# EAGLE design I2C 3-axis Compass (EAGLE 5.10)
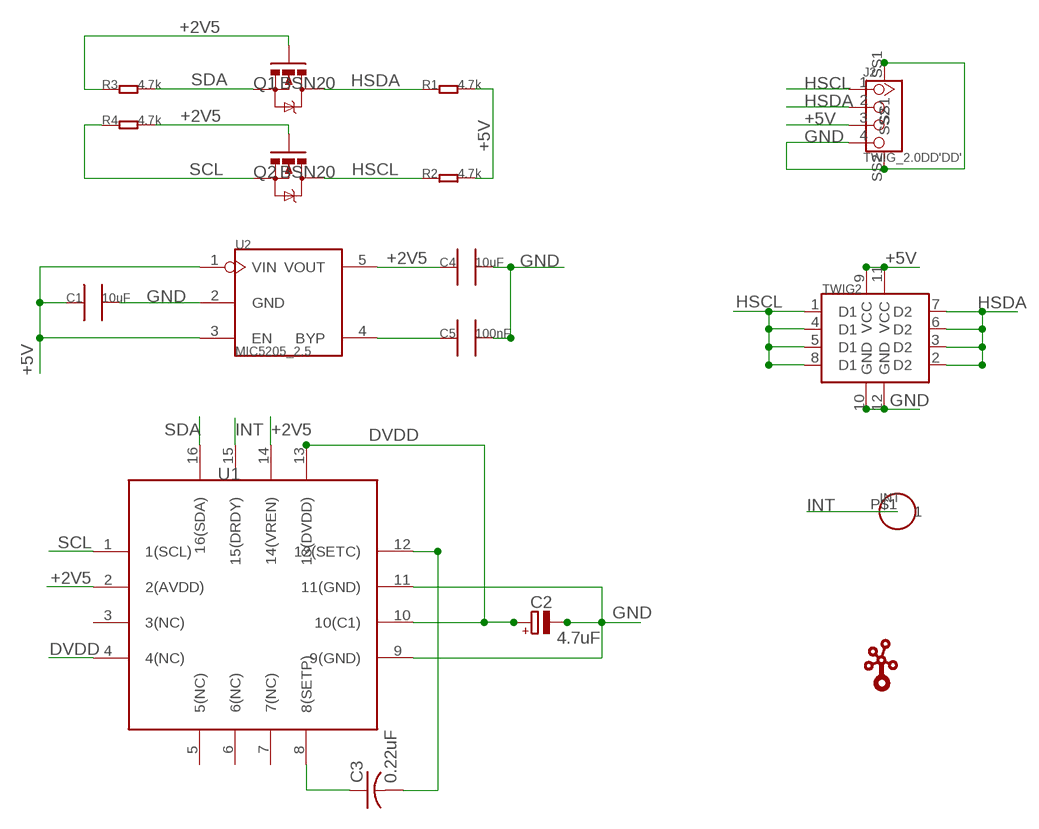
[diagram p0: schematic, sheet 1]

## Parts
C1  10uF  C0805_S  [0805_S]
C2  4.7uF  CPOL1206CPOL1206  [CPOL1206]
C3  0.22uF  C-USC0603  [C0603]
C4  10uF  C0805_S  [0805_S]
C5  100nF  C0603_S  [0603_S]
INT  CK_1X132  [CK_1X1]
J2  TWIG_2.0DD'DD'  [2.0_1X4DD]
Q1  BSN20  N_MOS  [SOT23]
Q2  BSN20  N_MOS  [SOT23]
R1  4.7k  R0603_S  [0603_S]
R2  4.7k  R0603_S  [0603_S]
R3  4.7k  R0603_S  [0603_S]
R4  4.7k  R0603_S  [0603_S]
TWIG2  TWIG-U1  [U1]
U1  HMC5883HMC5883  [HMC5883]
U2  MIC5205_2.5  MIC5025_X.X  [SOT23-5]
U$1  TWIGLOGOTWIGLOGO_SMALL  [TWIGLOGO_SMALL]

## Nets
+2V5: C4.1 Q1.1(G) Q2.1(G) R3.1 R4.2 U1.2(2(AVDD)) U1.14(14(VREN)) U2.5(VOUT)
+5V: C1.1 J2.3 R1.2 R2.2 TWIG2.9(VCC) TWIG2.11(VCC) U2.1(VIN) U2.3(EN)
DVDD: C2.2(+) U1.4(4(NC)) U1.10(10(C1)) U1.13(13(DVDD))
GND: C1.2 C2.1(-) C4.2 C5.2 J2.4 J2.SS1 J2.SS2 TWIG2.10(GND) TWIG2.12(GND) U1.9(9(GND)) U1.11(11(GND)) U2.2(GND)
HSCL: J2.1 Q2.3(D) R2.1 TWIG2.1(D1) TWIG2.4(D1) TWIG2.5(D1) TWIG2.8(D1)
HSDA: J2.2 Q1.3(D) R1.1 TWIG2.2(D2) TWIG2.3(D2) TWIG2.6(D2) TWIG2.7(D2)
INT: INT.P$1 U1.15(15(DRDY))
N$1: C3.2 U1.12(12(SETC))
N$2: C3.1 U1.8(8(SETP))
N$3: C5.1 U2.4(BYP)
SCL: Q2.2(S) R4.1 U1.1(1(SCL))
SDA: Q1.2(S) R3.2 U1.16(16(SDA))
Unconnected: U1.3(3(NC)) U1.5(5(NC)) U1.6(6(NC)) U1.7(7(NC))

## Library data of the parts
C1 C4 = CPT_SMD:C0805
C2 = rcl:CPOL1206
C3 = rcl:C-US: CAPACITOR, American symbol
C5 = CPT_SMD:C0603
INT = CONNECTER1:CK_1X1
J2 = CONNECTER:TWIG_2.0DD
Q1 Q2 = CPT_SMD:N_MOS
R1-R4 = CPT_SMD:R0603
TWIG2 = twig_template2:TWIG-U1
U1 = job:HMC5883
U2 = ICs_v54:MIC5025_X.X
U$1 = seeedleo:TWIGLOGO

## Net classes
0 default: width 0.203 mm, drill 0.305 mm, clearance 0.203 mm

## Board
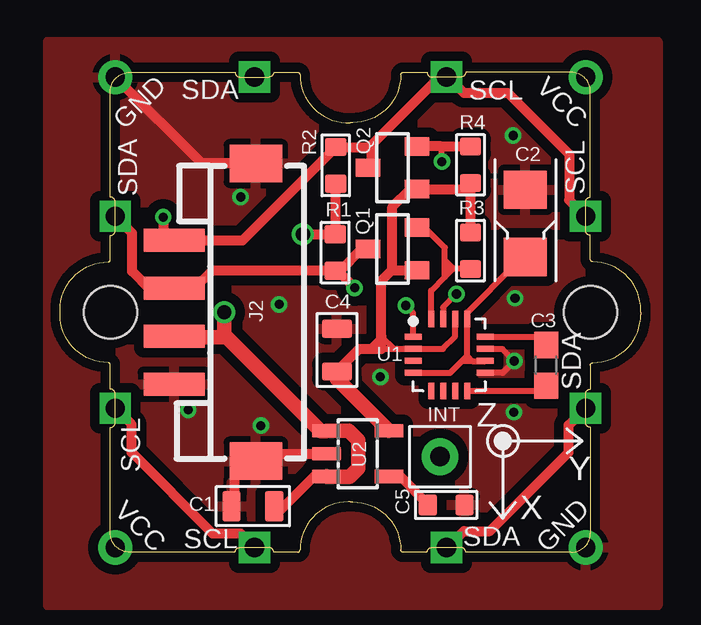
[diagram p1: board, top side]
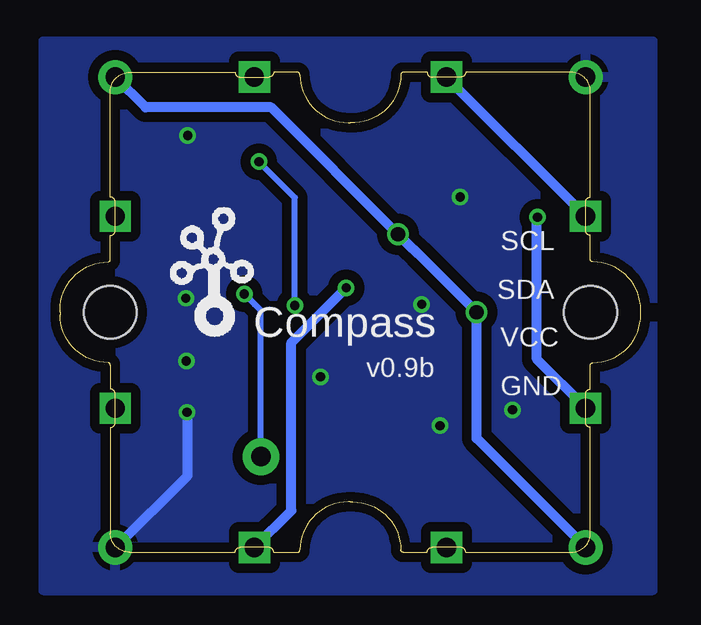
[diagram p2: board, bottom side, seen from below]

Size 24.2 x 20 mm. Coordinates in mm from the lower left corner, seen from the top.
Copper layers (1*16): Top 0.035mm / dielectric 1.5mm / Bottom 0.035mm
Design rules "SeeedStudio_rule_no_angle_090911": minimum track width 6mil, minimum drill 12mil, track to track 6mil, track to pad 6mil, pad to pad 6mil, via to via 6mil, smd to smd 0mil, copper to edge 10mil, drill to drill 10mil, minimum pad ring 10mil, minimum via ring 6mil, stop-mask expansion 2mil, vias tented up to drill 100mil, thermal gap 10mil

### Footprints (pad centres in the part's own frame; a part is rotated, then mirrored left to right if it is on the bottom)
0805_S = smd 0.762 x 1.27: 1 -0.889,0; 2 0.889,0
CPOL1206 = smd 1.6 x 1.8: 1 0,0; 2 2.8,0
C0603 = smd 1.1 x 1: 1 -0.85,0; 2 0.85,0
0603_S = smd 0.762 x 0.889: 1 -0.762,0; 2 0.762,0
CK_1X1 = drill 0.813 pad 1.524 round: P$1 0,0
2.0_1X4DD = smd 0.965 x 2.54: 1 -3,0; 2 -1,0; 3 1,0; 4 3,0 | smd 1.55 x 2.184: SS1 -6.2,3.4; SS2 6.2,3.4
SOT23 = smd 0.762 x 1.016: 1 -0.889,-1.016; 2 0.889,-1.016; 3 0,1.016
U1 = drill 0.8 pad 1.27 square: 1 -4,9.8; 2 4,9.8; 3 9.8,4; 4 9.8,-4; 5 4,-9.8; 6 -4,-9.8; 7 -9.8,-4; 8 -9.8,4 | drill 0.8 pad 1.422 round: 9 -9.8,9.8; 10 9.8,9.8; 11 9.8,-9.8; 12 -9.8,-9.8 | hole 2.2: 0,-10; 0,10
HMC5883 = smd 0.7 x 0.25: 1 0,2.25; 2 0,1.75; 3 0,1.25; 4 0,0.75; 9 3,0.75; 10 3,1.25; 11 3,1.75; 12 3,2.25 | smd 0.25 x 0.7: 5 0.75,0; 6 1.25,0; 7 1.75,0; 8 2.25,0; 13 2.25,3; 14 1.75,3; 15 1.25,3; 16 0.75,3
SOT23-5 = smd 0.55 x 1.2: 1 -0.95,-1.3; 2 0,-1.3; 3 0.95,-1.3; 4 0.95,1.3; 5 -0.95,1.3

### Placement (x,y rotation side)
C1  8.04,1.92 180 top
C2  19.39,15.11 270 top
C3  20.25,7.79 90 top
C4  11.54,8.43 90 top
C5  16.09,1.97 0 top
INT  15.83,3.98 270 top
J2  4.76,10 270 top
Q1  13.85,12.64 90 top
Q2  13.85,16.02 90 top
R1  11.46,12.49 90 top
R2  11.49,16.12 270 top
R3  17.1,12.57 270 top
R4  17.1,16.15 270 top
TWIG2  12.1,10 90 top
U1  14.72,6.72 0 top
U2  12.4,4.11 270 top
U$1  20,8.86 0 bottom

### Tracks (layer width: path | path; a pad name or v marks a point on that pad's centre or on a via)
+2V5
  Top 0.254: U1.14 16.47,8.98 15.96,8.47 U1.2 13.4,8.47 | 12.89,8.48 13.4,8.98 13.9,8.48
  Top 0.406: Q1.1 14.69,11.75 | C4.1 12.48,8.47 13.4,8.47 13.4,8.98 13.4,11.32 13.83,11.75 13.85,11.75 | Q1.1 14.59,11.75 | 13.85,11.75 13.85,14.39 14.59,15.13 Q2.1 16.93,15.13 R4.2 R3.1 | 13.85,11.75 Q1.1
  Top 0.61: C4.1 11.54,7.22 U2.5
+5V  (via drill 0.6)
  Top 0.406: R2.2 11.49,13.28 R1.2 v10.12,13.25 | U2.3 10.59,3.16 9.15,1.72 9.13,1.72 C1.1
  Top 0.61: 4.84,8.96 4.79,9 J2.3 4.8,8.96 6.82,8.96 | 11.11,3.17 U2.3 11.12,3.14 12.07,3.14 12.43,3.5 12.43,4.67 12.04,5.06 U2.1 10.86,5.05 6.94,8.96 6.82,8.96 | v6.84,10 6.84,8.98 6.82,8.96
  Bottom 0.406: TWIG2.9 6.84,4.74 v6.84,10 9.28,12.44 v10.12,13.25 15.4,18.53 20.63,18.53 TWIG2.11
DVDD
  Top 0.254: 16.97,8.18 U1.13 16.97,9.99 18.96,11.98 19.07,11.98 C2.2 | 16.97,8.18 17.18,7.97 | 17.18,7.97 U1.10 | U1.4 16.26,7.47 16.97,8.18 | 17.18,7.97 16.75,7.97
GND  (via drill 0.38)
  Top 0.254: U1.11 18.43,8.47 v18.93,7.97 18.44,7.47 U1.9
  Top 0.406: 7.63,16.22 8.14,16.22 J2.SS1 | J2.SS2 7.74,4.22 7.27,3.75 7.27,2.18 7.15,2.05 C1.2 | U2.2 8.47,4.11 J2.SS2 | J2.SS2 8.37,4.01 | 7.63,16.22 7.53,16.12 | 7.63,16.22 5.88,16.22 TWIG2.10 | C2.1 18.88,15.61
  Top 0.61: 4.15,6.98 4.74,6.98 J2.4 5.45,7 5.34,6.9
  Bottom 0.406: TWIG2.12 21.87,0.2 18.88,3.19 18.88,5.83 v18.91,5.83
  other vias: 18.88,17.37 9.13,10.33 7.53,14.8 8.37,5.28 5.34,5.94 13.34,7.31 18.96,10.58
  pour Bottom (isolate 0.406): -0.5,21.28 24.9,21.28 24.9,-1.58 -0.5,-1.58
  pour Top (isolate 0.406): -0.5,21.28 24.9,21.28 24.9,-2.22 -0.5,-2.22
HSCL  (via drill 0.38)
  Top 0.406: 12.58,16.02 Q2.3 12.96,16.15 12.96,16.96 | 12.96,16.96 15.8,19.8 TWIG2.4 16.17,19.8 16.82,19.14 18.65,19.14 21.22,16.58 21.22,14.67 TWIG2.5 | 12.96,16.96 12.89,16.88 R2.1 7.61,13 J2.1 4.3,13.46 v4.3,13.96 | TWIG2.1 2.98,5.33 2.98,4.16 6.36,0.78 7.52,0.78 TWIG2.8
  Bottom 0.406: TWIG2.1 2.3,6.02 4.33,8.04 4.33,13.94 v4.3,13.96
HSDA  (via drill 0.38)
  Top 0.406: R1.1 11.67,11.73 12.58,12.64 Q1.3 | 21.9,5.98 TWIG2.6 21.45,5.55 21.44,5.55 21.19,5.3 21.19,4.16 17.92,0.88 16.82,0.88 16.14,0.2 TWIG2.7 | R1.1 11.57,11.73 v12.28,11.02 | TWIG2.2 3.01,13.3 3.01,11.7 3.74,10.97 4.72,10.97 J2.2 5.6,10.99 6.33,11.73 R1.1
  Bottom 0.406: TWIG2.2 TWIG2.3 | 16.08,0.2 TWIG2.7 14.56,1.74 14.56,8.73 v12.28,11.02
INT  (via drill 0.38)
  Top 0.254: U1.15 15.97,10.21 v16.52,10.76
  Bottom 0.254: 16.09,10.33 v16.52,10.76 15.83,10.08 INT.P$1
N$1
  Top 0.254: U1.12 19.92,8.97 C3.2
N$2
  Top 0.254: U1.8 20.04,6.72 C3.1
N$3
  Top 0.406: C5.1 15.33,2 14.17,3.16 U2.4
SCL  (via drill 0.38)
  Top 0.254: U1.1 14.72,9.97 v14.41,10.28 | v15.91,16.27 15.91,16.88 15.88,16.91
  Top 0.406: Q2.2 15.88,16.91 R4.1
  Bottom 0.254: v14.41,10.28 14.41,14.78 v15.91,16.27
SDA
  Top 0.254: U1.16 15.47,10.9 16.04,11.47 | 16.04,11.47 16.04,11.9 | 16.04,11.9 16.11,11.83 16.37,11.83 | 16.37,11.83 17,11.83 R3.2 | 16.04,11.9 16.04,12.16 | 16.04,12.16 16.04,12.69 15.2,13.53 Q1.2 | 16.04,12.16 16.37,11.83 | 16.04,11.47 16.37,11.8

### Text on the board
tPlace: GND | SDA | SCL | VCC | SDA | SCL | SDA | Z | SCL | Y | GND | VCC | SCL | X | SDA
bPlace: SCL | SDA | VCC | Compass | GND | v0.9b